# EAGLE board FootPlate_v1 (EAGLE 9.0.0)
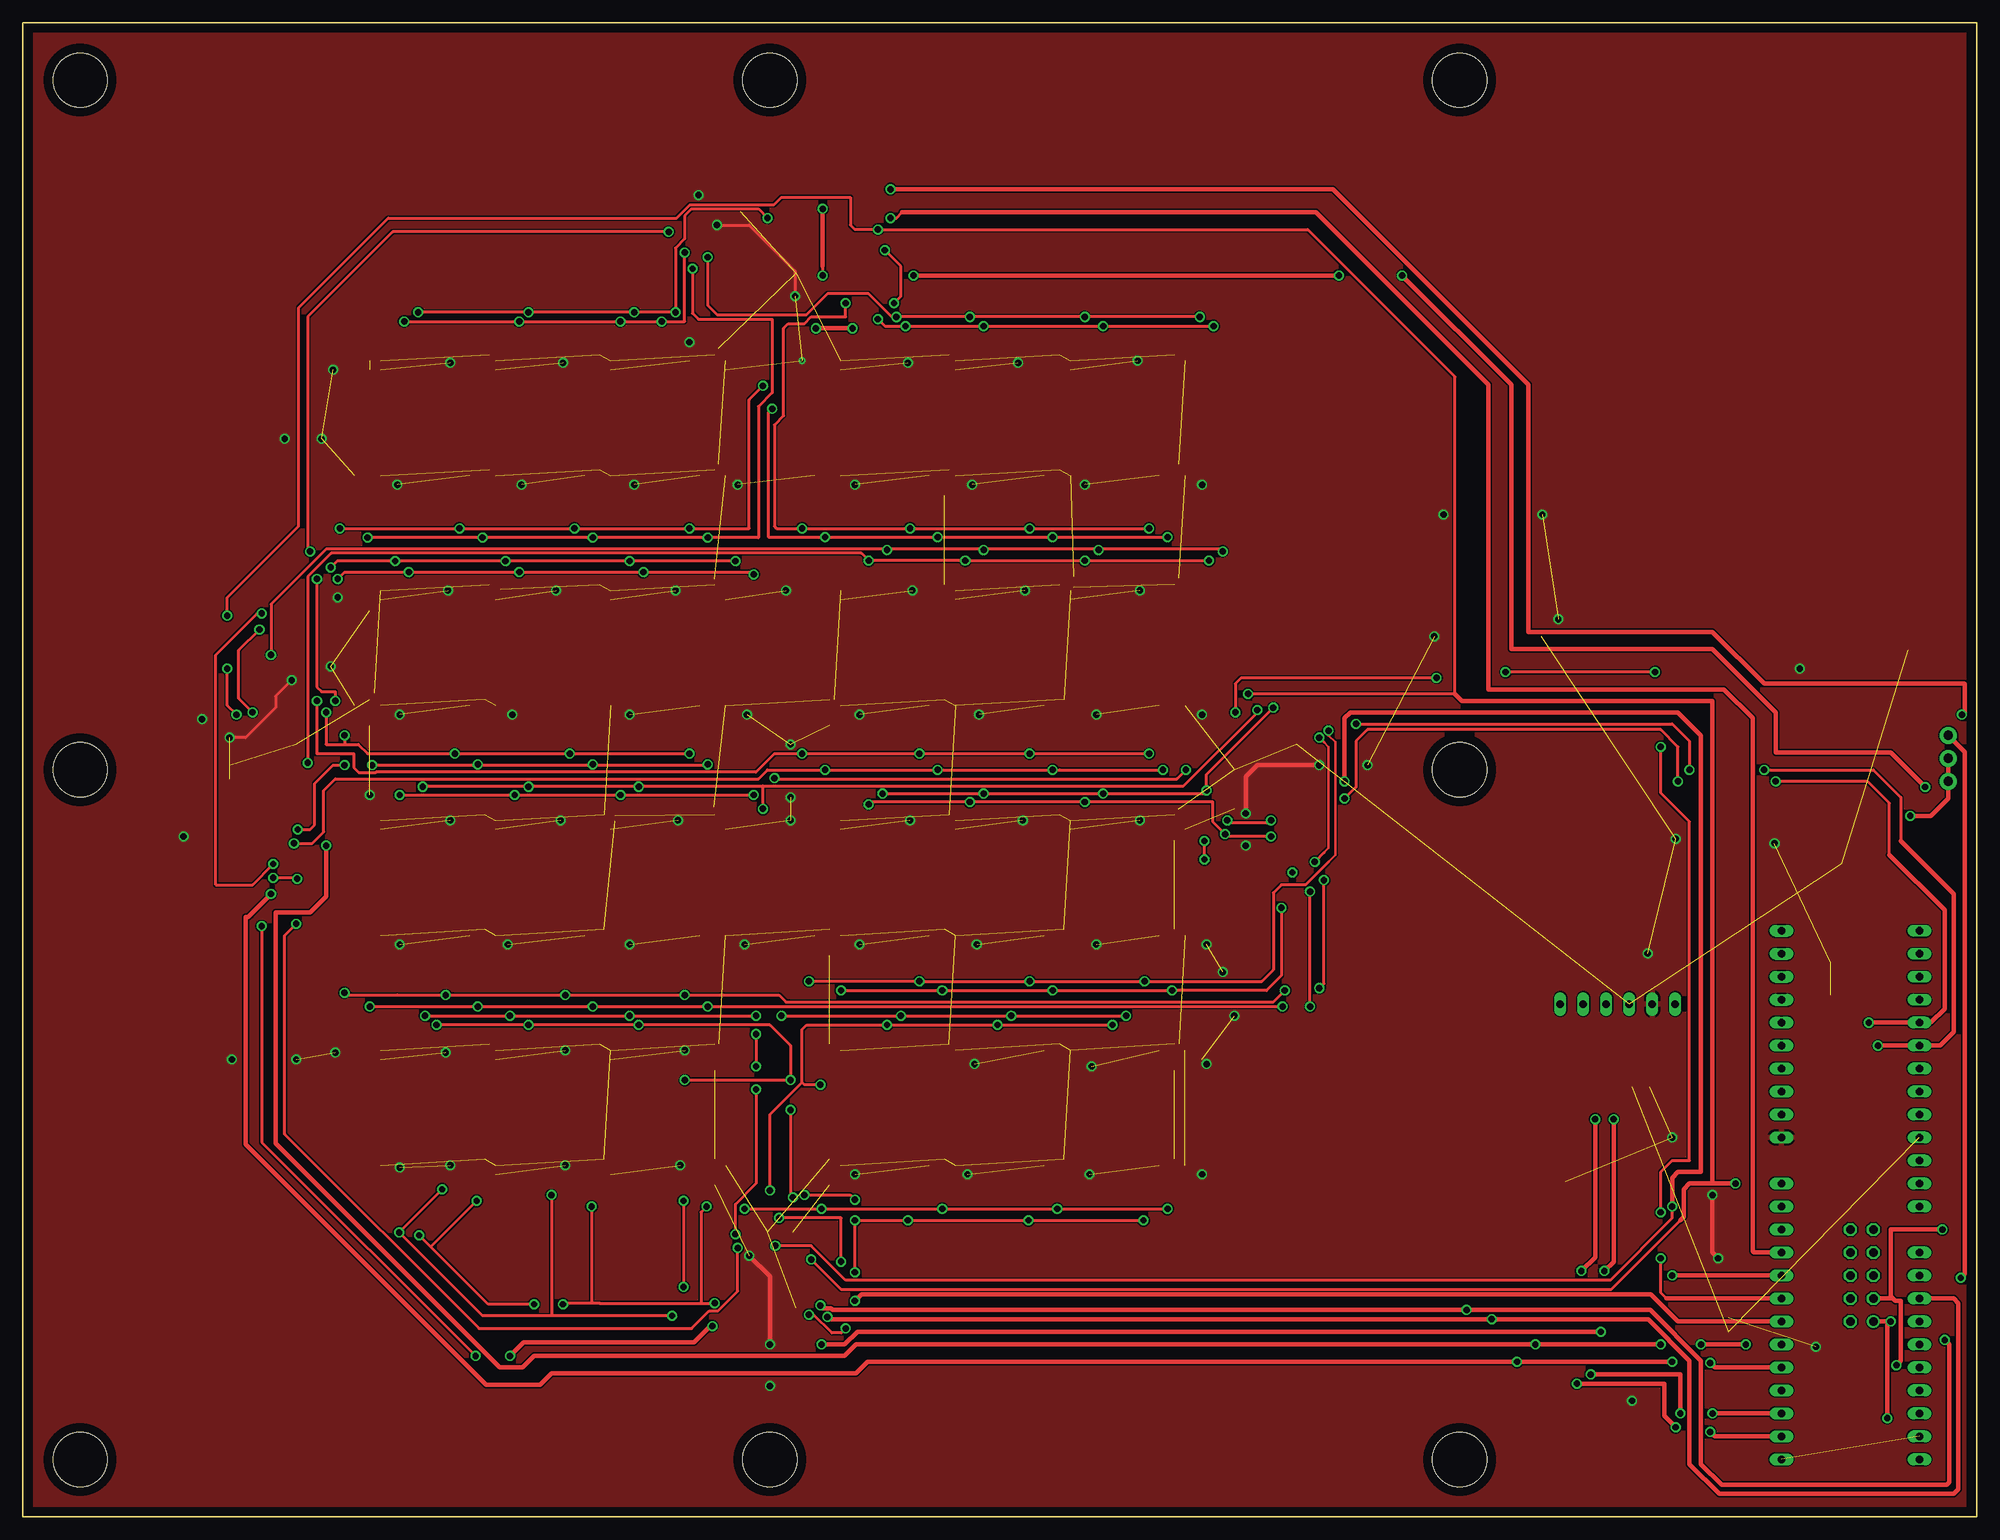
[diagram p5: board, top side]
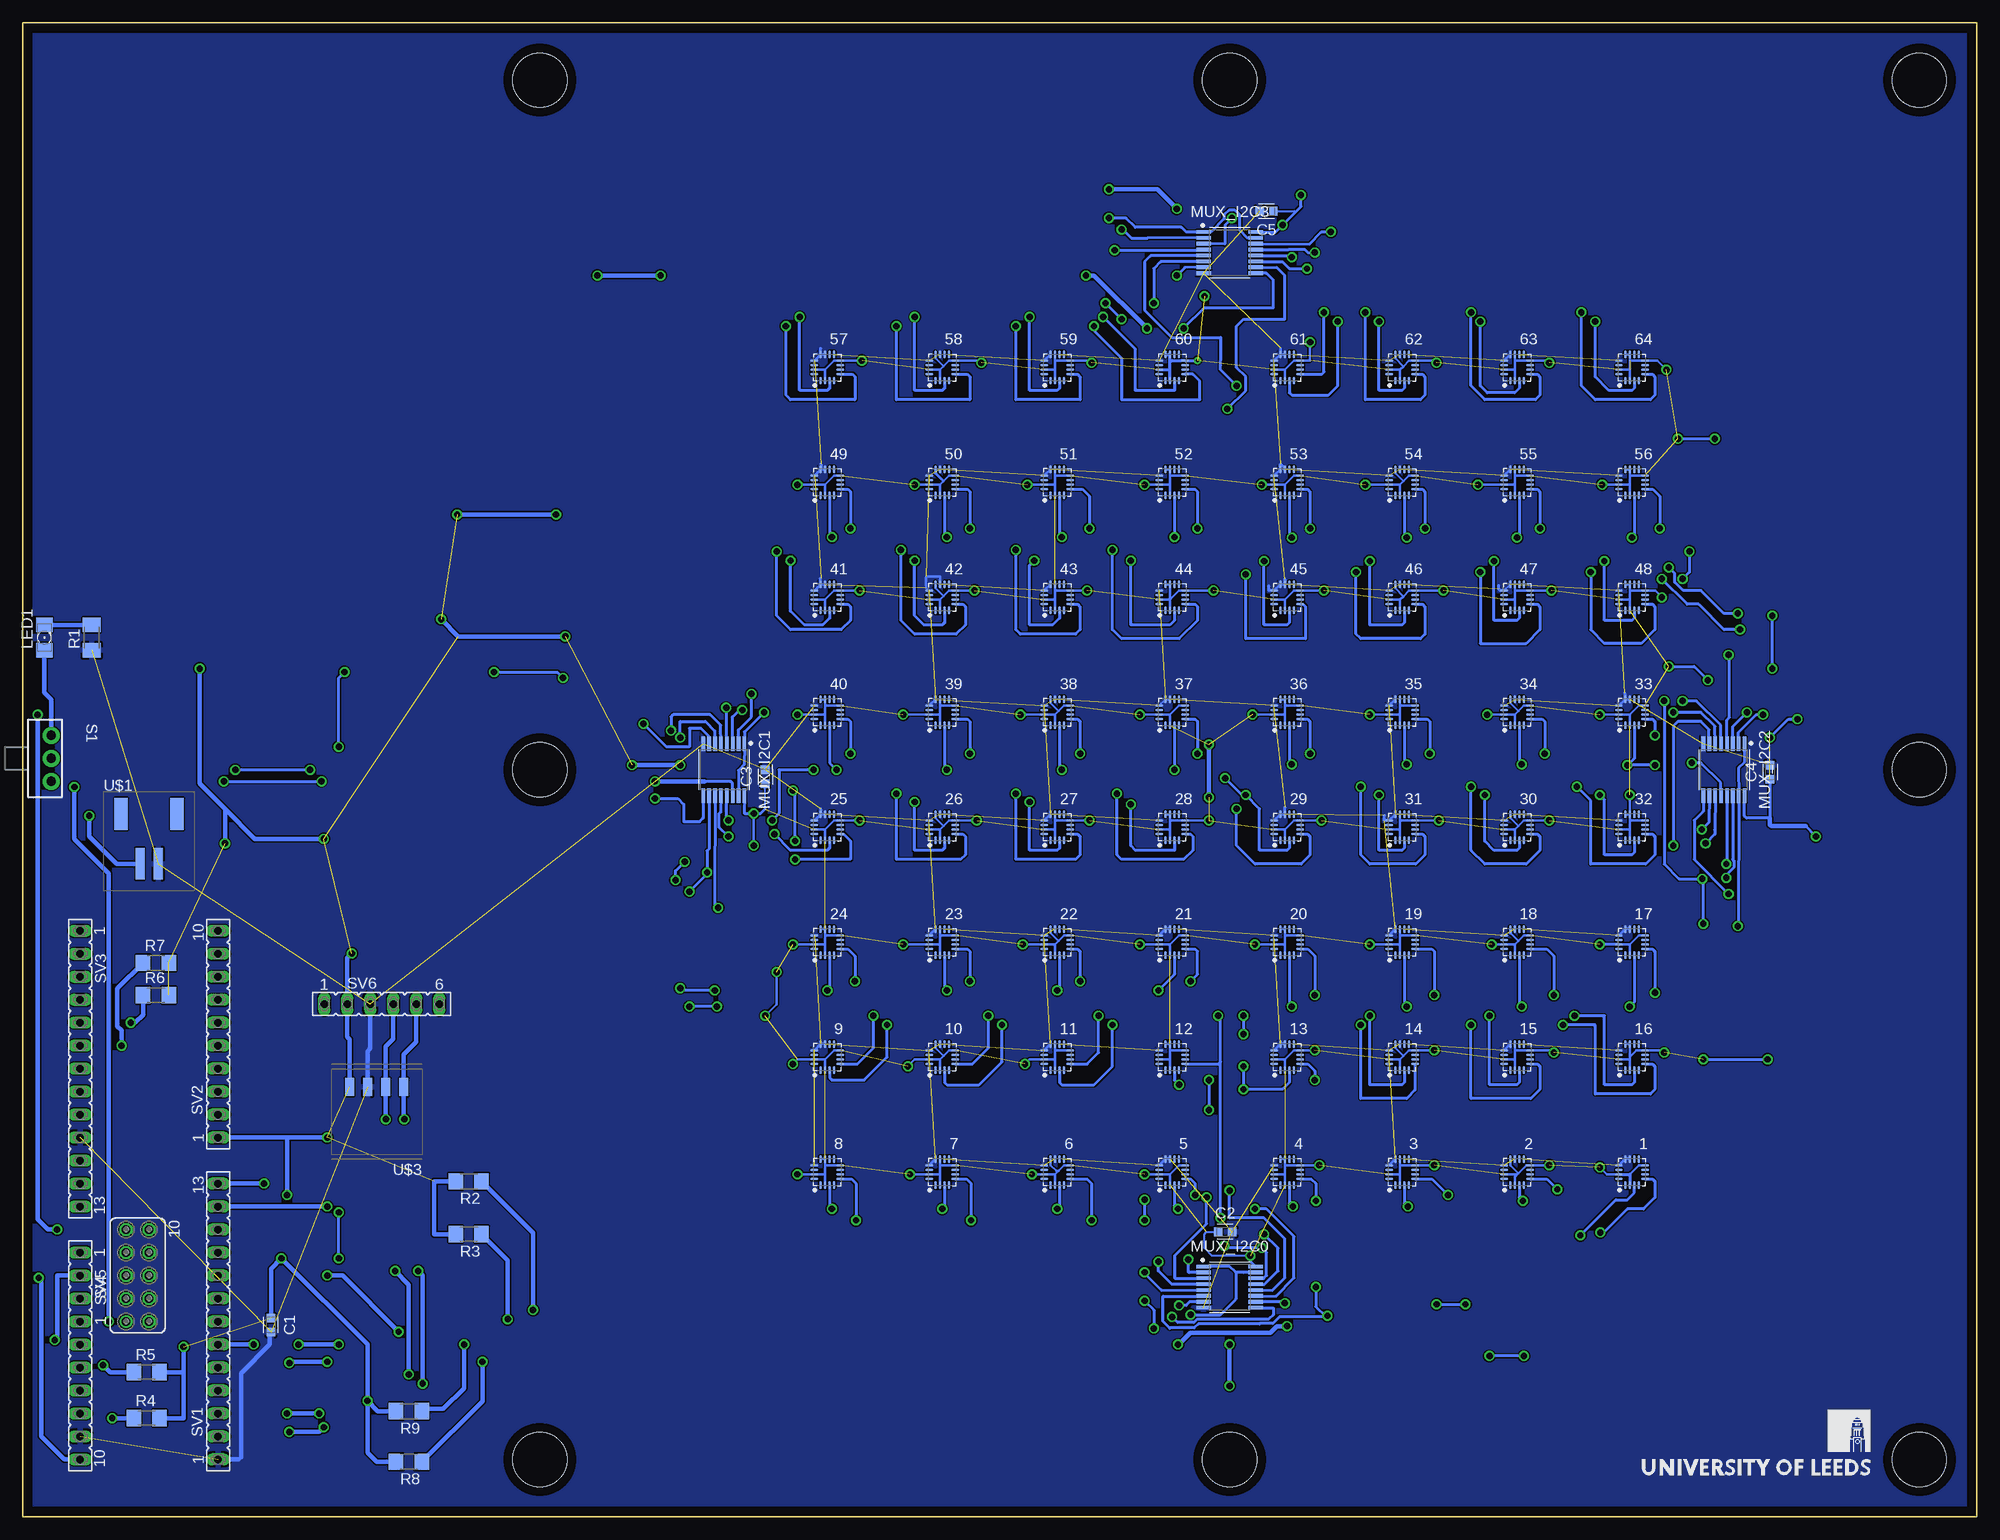
[diagram p6: board, bottom side, seen from below]

Size 215.9 x 165.1 mm. Coordinates in mm from the lower left corner, seen from the top.
Outline: 0,0 215.9,0 215.9,165.1 0,165.1 0,0
Copper layers (1*16): Top 0.035mm / dielectric 1.5mm / Bottom 0.035mm
Design rules "default": minimum track width 6mil, minimum drill 0.35mm, track to track 6mil, track to pad 6mil, pad to pad 6mil, via to via 6mil, smd to smd 6mil, copper to edge 40mil, drill to drill 6mil, minimum pad ring 10mil, minimum via ring 8mil, stop-mask expansion 4mil, vias tented up to drill 0mil, thermal gap 10mil
Holes 6 mm at 82.55,158.75 6.35,158.75 6.35,82.55 6.35,6.35 82.55,6.35 158.75,6.35 158.75,82.55 158.75,158.75

## Footprints (pad centres in the part's own frame; a part is rotated, then mirrored left to right if it is on the bottom)
MLX90393_PKG = smd 0.264 x 0.837: 4 0.75,-1.437; 9 0.75,1.437; 10 0.25,1.437; A0 -0.75,1.437; A1 -0.25,1.437; INT -0.75,-1.437; SCL 0.25,-1.437; SENB/CS -0.25,-1.437 | smd 0.837 x 0.264: 14 -1.437,0.25; 16 -1.437,-0.75; INT/TRIG 1.437,0.25; MISO 1.437,-0.25; SDA 1.437,-0.75; VDD -1.437,-0.25; VDD_IO 1.437,0.75; VSS -1.437,0.75
CAPC1608X75 = smd 0.931 x 0.98: 1 -0.77,0; 2 0.77,0
1206 = smd 1.6 x 1.803: A -1.422,0; C 1.422,0
SOP65P640X120-16 = smd 1.572 x 0.407: 1A -2.872,-1.625; 1B1 -2.872,-0.975; 1B2 -2.872,-0.325; 1B3 -2.872,0.325; 1B4 -2.872,0.975; 2A 2.872,-2.275; 2B1 2.872,-1.625; 2B2 2.872,-0.975; 2B3 2.872,-0.325; 2B4 2.872,0.325; !1OE -2.872,2.275; !2OE 2.872,1.625; GND -2.872,-2.275; S0 2.872,0.975; S1 -2.872,1.625; VCC 2.872,2.275
M1206 = smd 1.6 x 2: 1 -1.4,0; 2 1.4,0
R1206 = smd 1.6 x 1.803: 1 -1.422,0; 2 1.422,0
SWITCH = drill 1.016 pad 1.88: 1 0,2.54; 2 0,0; 3 0,-2.54
FE13 = drill 0.813 long: 1 -15.24,0; 2 -12.7,0; 3 -10.16,0; 4 -7.62,0; 5 -5.08,0; 6 -2.54,0; 7 0,0; 8 2.54,0; 9 5.08,0; 10 7.62,0; 11 10.16,0; 12 12.7,0; 13 15.24,0
FE10 = drill 0.813 long: 1 -11.43,0; 2 -8.89,0; 3 -6.35,0; 4 -3.81,0; 5 -1.27,0; 6 1.27,0; 7 3.81,0; 8 6.35,0; 9 8.89,0; 10 11.43,0
FE05-2 = drill 0.914: 1 -5.08,1.27 | drill 0.914 octagon: 2 -5.08,-1.27; 3 -2.54,1.27; 4 -2.54,-1.27; 5 0,1.27; 6 0,-1.27; 7 2.54,1.27; 8 2.54,-1.27; 9 5.08,1.27; 10 5.08,-1.27
FE06 = drill 0.813 long: 1 -6.35,0; 2 -3.81,0; 3 -1.27,0; 4 1.27,0; 5 3.81,0; 6 6.35,0
JST_PKG = smd 1 x 3.5: +3.7V -1,-2; GND 1,-2 | smd 1.5 x 3.5: P$3 -3.1,3.5; P$4 3.1,3.5
90DEG_F_HEADER_PKG = smd 1 x 2: 1 -3,0; 2 -1,0; 3 1,0; 4 3,0

## Placement (x,y rotation side)
1  0x00  [MLX90393_PKG]  38.1,38.1 0 bottom
2  0x01  [MLX90393_PKG]  50.8,38.1 0 bottom
3  0x10  [MLX90393_PKG]  63.5,38.1 0 bottom
4  0x11  [MLX90393_PKG]  76.2,38.1 0 bottom
5  0x00  [MLX90393_PKG]  88.9,38.1 0 bottom
6  0x01  [MLX90393_PKG]  101.6,38.1 0 bottom
7  0x10  [MLX90393_PKG]  114.3,38.1 0 bottom
8  0x11  [MLX90393_PKG]  127,38.1 0 bottom
9  0x00  [MLX90393_PKG]  127,50.8 0 bottom
10  0x01  [MLX90393_PKG]  114.3,50.8 0 bottom
11  0x10  [MLX90393_PKG]  101.6,50.8 0 bottom
12  0x11  [MLX90393_PKG]  88.9,50.8 0 bottom
13  0x00  [MLX90393_PKG]  76.2,50.8 0 bottom
14  0x01  [MLX90393_PKG]  63.5,50.8 0 bottom
15  0x10  [MLX90393_PKG]  50.8,50.8 0 bottom
16  0x11  [MLX90393_PKG]  38.1,50.8 0 bottom
17  0x00  [MLX90393_PKG]  38.1,63.5 0 bottom
18  0x01  [MLX90393_PKG]  50.8,63.5 0 bottom
19  0x10  [MLX90393_PKG]  63.5,63.5 0 bottom
20  0x11  [MLX90393_PKG]  76.2,63.5 0 bottom
21  0x00  [MLX90393_PKG]  88.9,63.5 0 bottom
22  0x01  [MLX90393_PKG]  101.6,63.5 0 bottom
23  0x10  [MLX90393_PKG]  114.3,63.5 0 bottom
24  0x11  [MLX90393_PKG]  127,63.5 0 bottom
25  0x00  [MLX90393_PKG]  127,76.2 0 bottom
26  0x01  [MLX90393_PKG]  114.3,76.2 0 bottom
27  0x10  [MLX90393_PKG]  101.6,76.2 0 bottom
28  0x11  [MLX90393_PKG]  88.9,76.2 0 bottom
29  0x00  [MLX90393_PKG]  76.2,76.2 0 bottom
30  0x01  [MLX90393_PKG]  50.8,76.2 0 bottom
31  0x10  [MLX90393_PKG]  63.5,76.2 0 bottom
32  0x11  [MLX90393_PKG]  38.1,76.2 0 bottom
33  0x00  [MLX90393_PKG]  38.1,88.9 0 bottom
34  0x01  [MLX90393_PKG]  50.8,88.9 0 bottom
35  0x10  [MLX90393_PKG]  63.5,88.9 0 bottom
36  0x11  [MLX90393_PKG]  76.2,88.9 0 bottom
37  0x00  [MLX90393_PKG]  88.9,88.9 0 bottom
38  0x01  [MLX90393_PKG]  101.6,88.9 0 bottom
39  0x10  [MLX90393_PKG]  114.3,88.9 0 bottom
40  0x11  [MLX90393_PKG]  127,88.9 0 bottom
41  0x00  [MLX90393_PKG]  127,101.6 0 bottom
42  0x01  [MLX90393_PKG]  114.3,101.6 0 bottom
43  0x10  [MLX90393_PKG]  101.6,101.6 0 bottom
44  0x11  [MLX90393_PKG]  88.9,101.6 0 bottom
45  0x00  [MLX90393_PKG]  76.2,101.6 0 bottom
46  0x01  [MLX90393_PKG]  63.5,101.6 0 bottom
47  0x10  [MLX90393_PKG]  50.8,101.6 0 bottom
48  0x11  [MLX90393_PKG]  38.1,101.6 0 bottom
49  0x00  [MLX90393_PKG]  127,114.3 0 bottom
50  0x01  [MLX90393_PKG]  114.3,114.3 0 bottom
51  0x10  [MLX90393_PKG]  101.6,114.3 0 bottom
52  0x11  [MLX90393_PKG]  88.9,114.3 0 bottom
53  0x00  [MLX90393_PKG]  76.2,114.3 0 bottom
54  0x01  [MLX90393_PKG]  63.5,114.3 0 bottom
55  0x10  [MLX90393_PKG]  50.8,114.3 0 bottom
56  0x11  [MLX90393_PKG]  38.1,114.3 0 bottom
57  0x00  [MLX90393_PKG]  127,127 0 bottom
58  0x01  [MLX90393_PKG]  114.3,127 0 bottom
59  0x10  [MLX90393_PKG]  101.6,127 0 bottom
60  0x11  [MLX90393_PKG]  88.9,127 0 bottom
61  0x00  [MLX90393_PKG]  76.2,127 0 bottom
62  0x01  [MLX90393_PKG]  63.5,127 0 bottom
63  0x10  [MLX90393_PKG]  50.8,127 0 bottom
64  0x11  [MLX90393_PKG]  38.1,127 0 bottom
C1  0.1uF  [CAPC1608X75]  188.47,21.21 270 bottom
C2  0.1uF  [CAPC1608X75]  83.06,31.5 0 bottom
C3  0.1uF  [CAPC1608X75]  133.86,81.79 90 bottom
C4  0.1uF  [CAPC1608X75]  22.86,82.3 90 bottom
C5  0.1uF  [CAPC1608X75]  78.49,144.27 180 bottom
LED1  [1206]  213.49,97.16 90 bottom
MUX_I2C0  SN74_MUXMUX_PKG_V2  [SOP65P640X120-16]  82.55,25.4 0 bottom
MUX_I2C1  SN74_MUXMUX_PKG_V2  [SOP65P640X120-16]  138.43,82.55 270 bottom
MUX_I2C2  SN74_MUXMUX_PKG_V2  [SOP65P640X120-16]  27.94,82.55 270 bottom
MUX_I2C3  SN74_MUXMUX_PKG_V2  [SOP65P640X120-16]  82.55,139.7 0 bottom
R1  80 Ohm  [M1206]  208.28,97.16 90 bottom
R2  4.7k  [R1206]  166.62,37.08 180 bottom
R3  4.7k  [R1206]  166.62,31.24 180 bottom
R4  4.7k  [R1206]  202.18,10.92 0 bottom
R5  4.7k  [R1206]  202.18,16 0 bottom
R6  4.7k  [R1206]  201.17,57.66 0 bottom
R7  4.7k  [R1206]  201.17,61.21 0 bottom
R8  4.7k  [R1206]  173.23,6.1 180 bottom
R9  4.7k  [R1206]  173.23,11.68 180 bottom
S1  [SWITCH]  212.72,83.82 0 bottom
SV1  [FE13]  194.31,21.59 90 bottom
SV2  [FE10]  194.31,53.34 90 bottom
SV3  [FE13]  209.55,49.53 270 bottom
SV4  [FE10]  209.55,17.78 270 bottom
SV5  [FE05-2]  203.2,26.67 90 bottom
SV6  [FE06]  176.23,56.67 0 bottom
U$1  JST_CONNECTOR  [JST_PKG]  201.93,74.17 0 bottom
U$2  [LOGO_LARGE]  37.05,4.55 0 bottom
U$3  90DEG_F_HEADER  [90DEG_F_HEADER_PKG]  176.78,47.5 180 bottom

## Tracks (layer width: path | path; a pad name or v marks a point on that pad's centre or on a via)
!OE0  (via drill 0.7 pad 0.7)
  Top 0.305: v90.93,20.83 90.42,20.32 89.41,20.32 87.38,22.35 v86.87,22.35
  Top 0.508: SV1.7 182.88,21.59 180.97,23.5 180.59,23.88 179.88,24.59 92.66,24.59 v91.95,23.88
  Bottom 0.305: MUX_I2C0.!2OE 81.03,27 81.86,27 | 81.86,27 82.55,27.69 85.26,27.69 MUX_I2C0.!1OE | v91.95,23.88 90.93,22.86 v90.93,20.83 | 81.86,27 81.86,24.05 83.57,22.35 v86.87,22.35
!OE1  (via drill 0.7 pad 0.95)
  Top 0.305: 181.61,24.13 180.97,24.77 v180.97,28.57 | v180.97,33.66 180.97,38.1 182.25,39.37 184.15,39.37 184.15,76.83 180.97,80.01 v180.97,85.09 | v180.34,93.34 v163.83,93.34 | v156.21,92.71 134.62,92.71 133.99,92.08 v133.99,88.9
  Top 0.508: SV1.8 181.61,24.13
  Bottom 0.305: MUX_I2C1.!2OE 136.83,82.47 136.18,83.12 136.16,85.09 | MUX_I2C1.!1OE 136.16,85.09 | v180.97,28.57 v180.97,33.66 | v180.97,85.09 180.97,92.71 v180.34,93.34 | v163.83,93.34 156.84,93.34 v156.21,92.71 | 136.16,85.09 136.16,86.73 v133.99,88.9
!OE2  (via drill 0.7 pad 0.7, 0.7 pad 0.95)
  Top 0.305: v26.42,65.28 26.42,41.4 v50.04,17.78
  Top 0.508: v53.85,17.78 55.37,19.3 74.17,19.3 75.95,21.08 v76.2,21.08 | v174.36,20.46 92.21,20.46 90.81,19.05 v88.27,19.05 | SV1.9 v182.25,26.67
  Bottom 0.305: MUX_I2C2.!1OE 25.69,83.38 26.34,82.73 MUX_I2C2.!2OE 26.34,65.35 v26.42,65.28 | v50.04,17.78 v53.85,17.78
  Bottom 0.508: v76.2,21.08 77.3,21.08 78.06,20.32 86.87,20.32 88.14,19.05 v88.27,19.05 | v182.25,26.67 180.57,26.67 v174.36,20.46
!OE3  (via drill 0.7 pad 0.95)
  Top 0.305: v95.89,143.51 96.52,143.51 97.16,144.15
  Top 0.508: 97.16,144.15 142.88,144.15 161.93,125.09 161.93,91.44 187.96,91.44 191.13,88.27 191.13,29.34 191.26,29.21 SV1.10
  Bottom 0.305: MUX_I2C3.!2OE 80.59,141.3 81.44,142.14 81.44,143.87 81.94,144.37 82.65,144.37 83.15,143.87 83.15,143.41 84.62,141.95 MUX_I2C3.!1OE 87.34,141.95 87.88,142.49 92.96,142.49 93.98,143.51 v95.89,143.51
+3.7V  (via drill 0.7 pad 0.95)
  Top 0.508: S1.1 214.55,84.53 214.55,26.85 v214.12,26.42
  Bottom 0.508: v214.12,26.42 213.87,26.16 213.87,8.89 211.33,6.35 SV4.10 | S1.1 212.72,90.3 213.49,91.06 LED1.A
BT_RX  (via drill 0.7 pad 0.95)
  Top 0.508: SV1.2 186.94,8.89 v186.44,9.4 | v173.74,43.94 173.74,28.7 v172.21,27.18 | v171.7,14.73 181.36,14.73 181.36,11.18 v182.63,9.91
  Bottom 0.508: v173.74,43.94 173.78,43.99 U$3.1 173.78,51.11 172.41,52.48 SV6.5 | v172.21,27.18 171.7,26.67 v171.7,14.73 | v182.63,9.91 183.13,9.4 v186.44,9.4
BT_TX  (via drill 0.7 pad 0.95)
  Top 0.508: SV1.3 v186.69,11.43 | v183.13,11.43 183.13,15.75 v173.23,15.75 | v174.75,27.18 175.77,28.19 v175.77,43.94
  Bottom 0.508: v186.69,11.43 v183.13,11.43 | v173.23,15.75 173.23,25.65 v174.75,27.18 | v175.77,43.94 175.77,47.48 U$3.2 175.78,52 174.96,52.83 SV6.4
GND  (92 unrouted)
  Bottom 0.254: 37.A1 37.A0 37.VSS | 47.A0 47.VSS | 42.A1 114.55,103.89 116.08,103.89 116.08,102.69 42.VSS
  Bottom 0.305: 1.A1 1.A0 1.VSS | 17.A1 17.A0 17.VSS | 63.A0 63.VSS | 61.A1 61.A0 | 61.A0 61.VSS | 59.A0 59.VSS | 57.A1 57.A0 | 57.A0 57.VSS | 49.A1 49.A0 | 49.A0 49.VSS | 51.A0 51.VSS | 53.A1 76.5,115.74 76.5,115.93 76.91,116.33 76.95,116.29 53.A0 53.VSS | 55.A0 55.VSS | 43.A0 43.VSS | 41.A1 41.A0 | 41.A0 41.VSS | 39.A0 39.VSS | 35.A0 35.VSS | 33.A1 33.A0 | 33.A0 33.VSS | 31.A0 31.VSS 65.39,76.95 65.43,76.91 65.43,77.52 | 29.VSS 29.A0 29.A1 76.45,78.39 76.4,78.44 | 27.A0 27.VSS | 25.A1 25.A0 | 25.A0 25.VSS | 23.A0 23.VSS | 21.A1 21.A0 21.VSS | 19.A0 19.VSS | 15.A0 15.VSS | 13.A1 13.A0 13.VSS | 11.A0 11.VSS | 9.A1 9.A0 9.VSS | 7.A0 7.VSS | 5.A1 5.A0 5.VSS | 3.A0 3.VSS | 45.A1 76.45,103.63 45.A1 45.A0 45.VSS 77.65,102.36 78.23,102.36 78.23,102.87 | 127.71,116.33 127.71,115.78 49.A0 | 57.A0 127.75,129.09 127.71,129.13 | 61.A0 76.91,128.48 76.91,129.13 | 47.VSS 52.67,102.35 52.83,102.51 52.83,102.92 | 41.A0 127.75,103.69 127.71,103.73 | 33.A0 38.85,90.97 38.91,91.03 | 25.A0 127.71,77.68 127.71,78.23
  Bottom 0.508: C1.2 188.59,20.31 188.59,19.05 191.77,15.88 191.77,6.6 192.02,6.35 SV1.1 | SV6.3 177.5,51.74 177.78,51.45 U$3.3
  pour Bottom: -2.54,165.35 -2.54,-1.78 -1.02,-3.3 218.19,-3.05 218.19,163.32 216.66,164.85 -2.03,164.85
N$1
  Bottom 0.508: R1.2 213.97,98.56 LED1.C
N$2  (via drill 0.7 pad 0.95)
  Top 0.508: S1.2 S1.3 212.72,79.38 210.82,77.47 v208.53,77.47
  Bottom 0.508: U$1.+3.7V 205.52,72.17 208.53,75.18 v208.53,77.47
S0  (via drill 0.7 pad 0.7, 0.7 pad 0.95)
  Top 0.305: v78.99,29.72 78.99,24.95 76.81,22.76 75.85,22.76 73.91,20.83 50.41,20.83 28.96,42.28 28.96,64.26 v30.23,65.53 | v71.37,141.99 40.89,141.99 31.5,132.59 31.5,106.93 v31.75,106.68 | v34.54,90.17 34.54,91.19 33.02,91.19 32.51,91.69 v32.51,103.63 | v27.69,70.61 30.23,70.61 v30.32,70.51 | v83.15,29.97 87.12,29.97 90.93,26.16 175.39,26.16 182.25,33.02 v182.25,34.29
  Top 0.508: v182.25,34.29 182.25,37.47 182.88,38.1 185.42,38.1 185.42,86.36 182.88,88.9 146.69,88.9 146.05,88.27 v146.05,81.28
  Bottom 0.305: MUX_I2C0.S0 78.81,26.35 78.49,26.67 78.49,29.21 v78.99,29.72 82.9,29.72 v83.15,29.97 | v27.69,70.61 27.69,70.92 26.83,71.78 26.83,72.49 26.99,72.65 MUX_I2C2.S0 | MUX_I2C3.S0 73.73,140.65 72.39,141.99 v71.37,141.99 | v34.54,90.17 34.54,72.14 32.92,70.51 v30.32,70.51 30.23,70.42 v30.23,65.53 | MUX_I2C1.S0 137.48,81.09 137.67,81.28 140.56,81.28 | v31.75,106.68 31.75,104.39 v32.51,103.63
  Bottom 0.508: SV1.12 v182.25,34.29 | v146.05,81.28 140.56,81.28
S1  (via drill 0.7 pad 0.7, 0.7 pad 0.95)
  Top 0.305: v23.62,88.65 22.61,89.66 v22.61,93.73 | v22.61,99.57 22.61,101.6 30.48,109.47 30.48,133.6 40.39,143.51 72.25,143.51 73.72,144.98 83.01,144.98 83.82,145.8 91.44,145.8 91.44,142.75 91.95,142.24 v94.49,142.24 141.99,142.24 158.24,125.98 158.24,90.93 v135.38,90.93 | v87.12,28.45 90.42,25.15 175.51,25.15 183.13,32.77
  Top 0.508: 158.24,90.93 159,90.17 186.69,90.17 186.69,36.83 | 183.13,32.77 183.51,33.15 183.51,36.2 184.15,36.83 186.69,36.83 | 186.69,36.83 v189.23,36.83
  Bottom 0.305: MUX_I2C2.S1 26.34,86.69 24.38,88.65 v23.62,88.65 | v22.61,93.73 v22.61,99.57 | MUX_I2C3.S1 91.62,141.3 93.4,141.3 94.34,142.24 v94.49,142.24 | MUX_I2C1.S1 136.83,86.94 135.38,88.39 v135.38,90.93 | MUX_I2C0.S1 87.05,27 87.12,27.08 v87.12,28.45
  Bottom 0.508: v189.23,36.83 SV1.13
SCL0  (via drill 0.7, 0.7 pad 0.95)
  Top 0.508: SV4.3 213.36,24.13 213.87,23.62 213.87,3.05 213.36,2.54 187.45,2.54 184.15,5.84 184.15,17.27 179.58,21.84 v162.31,21.84 89.15,21.84 v88.9,22.1
  Bottom 0.305: MUX_I2C0.2A 77.74,23.1 77.74,22.35 78.25,21.84 86.16,21.84 86.51,21.49 88.3,21.49 v88.9,22.1
  Bottom 0.508: R3.1 162.31,28.35 v162.31,21.84
SCL0_0  (via drill 0.7 pad 0.95)
  Top 0.305: 63.75,23.62 74.93,23.62 | 74.93,23.62 v76.45,23.62 v76.45,23.63 | 63.75,23.63 63.75,23.62 | v75.56,34.29 74.93,33.66 74.93,23.62 | 63.75,23.62 62.87,23.62 | 62.87,23.62 59.82,23.62 v59.69,23.5 | v56.52,23.5 51.44,23.5 45.09,29.84 | 45.09,29.84 v43.81,31.11 | v50.16,34.92 45.09,29.84 | v62.87,34.29 62.87,23.62
  Bottom 0.305: v76.45,23.62 76.58,23.75 MUX_I2C0.2B1 | 4.SCL 75.95,34.67 v75.56,34.29 | 3.SCL 63.25,34.67 v62.87,34.29 | v59.69,23.5 v56.52,23.5 | 1.SCL 37.85,35.81 38.61,35.05 39.88,35.05 v43.81,31.11 | 2.SCL 50.55,35.31 v50.16,34.92
SCL0_1  (via drill 0.7 pad 0.95)
  Top 0.305: v79.76,34.04 v88.27,34.04 v101.6,34.04 v114.3,34.04 v126.49,34.04
  Bottom 0.305: MUX_I2C0.2B2 77.45,24.4 75.44,26.42 75.44,30.99 78.49,34.04 v79.76,34.04 | 5.SCL 88.65,34.42 v88.27,34.04 | 6.SCL 101.35,34.29 v101.6,34.04 | 7.SCL 114.05,34.29 v114.3,34.04 | 8.SCL 126.75,34.29 v126.49,34.04
SCL0_2  (via drill 0.7 pad 0.95)
  Top 0.305: v82.55,36.07 82.55,44.45 86.11,48.01 | 86.11,48.01 86.11,53.85 86.61,54.36 v95.5,54.36 v107.7,54.36 v120.4,54.36 | 86.11,48.01 86.36,47.75 v88.14,47.75
  Bottom 0.305: MUX_I2C0.2B3 77.82,25.05 76.45,26.42 76.45,30.73 78.74,33.02 82.55,33.02 v82.55,36.07 | 12.SCL 88.65,48.26 v88.14,47.75 | 11.SCL 101.35,48.01 101.09,47.75 97.54,47.75 95.5,49.78 v95.5,54.36 | 10.SCL 114.05,48.01 113.79,47.75 110.24,47.75 107.7,50.29 v107.7,54.36 | 9.SCL 126.75,48.52 126.49,48.26 122.94,48.26 120.4,50.8 v120.4,54.36
SCL0_3  (via drill 0.7 pad 0.95)
  Top 0.305: v78.74,31.24 78.74,34.54 81.03,36.83 v81.03,47.24 | v81.03,53.34 v81.03,49.78 | v44.45,55.37 v53.85,55.37 v67.06,55.37 v81.03,55.37
  Bottom 0.305: MUX_I2C0.2B4 78.69,25.7 77.22,27.18 77.22,29.72 v78.74,31.24 | v81.03,55.37 v81.03,53.34 | v81.03,49.78 v81.03,47.24 76.71,47.24 75.95,48 13.SCL | 16.SCL 37.85,48 38.1,47.75 41.15,47.75 41.15,55.37 v44.45,55.37 | 15.SCL 50.55,48 50.8,47.75 53.85,47.75 v53.85,55.37 | 14.SCL 63.25,48 63.5,47.75 67.06,47.75 v67.06,55.37
SCL1  (via drill 0.7 pad 0.95)
  Top 0.305: 206.25,73.15 206.25,78.87 203.84,81.28 v193.68,81.28 | v182.88,81.28 182.88,85.09 180.97,87 148.59,87 147.32,85.72 147.32,80.64 v146.05,79.38
  Top 0.508: 206.25,73.15 212.34,67.06 212.34,56.13 210.82,54.61 SV3.5 v203.96,54.61
  Bottom 0.305: MUX_I2C1.2A 140.73,77.23 140.72,77.22 141.1,76.83 142.88,76.83 142.88,78.74 143.51,79.38 v146.05,79.38 | v193.68,81.28 v182.88,81.28
  Bottom 0.508: R6.1 202.59,55.47 203.45,54.61 v203.96,54.61
SCL1_0  (via drill 0.7, 0.7 pad 0.95)
  Top 0.305: v142.24,56.39 v142.24,69.09 | v38.35,56.39 v50.29,56.39 v62.99,56.39 v75.69,56.39 v139.19,56.39
  Bottom 0.305: MUX_I2C1.2B1 140.08,73.79 140.29,73.58 v140.29,71.2 140.29,71.04 v142.24,69.09 | v139.19,56.39 v142.24,56.39 | 17.SCL 37.85,56.89 v38.35,56.39 | 18.SCL 50.55,56.65 v50.29,56.39 | 19.SCL 63.25,56.65 v62.99,56.39 | 20.SCL 75.95,56.65 v75.69,56.39
SCL1_1  (via drill 0.7 pad 0.95)
  Top 0.305: v90.42,58.17 v101.6,58.17 v113.79,58.17 114.55,58.17 | 114.55,58.17 v127,58.17 137.41,58.17 139.06,59.82 v139.06,67.31 | 114.55,58.17
  Bottom 0.305: MUX_I2C1.2B2 139.43,68.58 | 139.43,68.58 139.43,68.33 | 23.SCL 114.05,58.42 v113.79,58.17 | 22.SCL 101.35,58.42 v101.6,58.17 | 24.SCL 126.75,58.42 v127,58.17 | 139.43,68.58 139.43,67.67 v139.06,67.31 | 21.SCL 88.65,59.94 v90.42,58.17
SCL1_2  (via drill 0.7 pad 0.95)
  Top 0.305: v93.47,78.74 93.73,78.99 v104.65,78.99 v117.35,78.99 131.48,78.99 131.48,76.8 v132.84,75.44 133.1,75.18 v137.92,75.18
  Bottom 0.305: v137.92,75.18 138.94,76.2 138.94,77.72 138.78,77.88 MUX_I2C1.2B3 | 28.SCL 88.65,73.66 92.96,73.66 93.47,74.17 v93.47,78.74 | 27.SCL 101.35,73.91 101.6,73.66 104.65,73.66 v104.65,78.99 | 26.SCL 114.05,73.91 114.3,73.66 117.35,73.66 v117.35,78.99 | 25.SCL 126.75,73.91 127,73.66 131.06,73.66 v132.84,75.44
SCL1_3  (via drill 0.7 pad 0.95)
  Top 0.305: v133.1,76.96 133.35,76.71 137.67,76.71 v137.92,76.96 | v83.06,81.63 83.06,81.53 127.51,81.53 v128.52,82.55 | v41.66,79.76 v54.36,79.76 v66.04,79.76 v80.77,79.76
  Bottom 0.305: MUX_I2C1.2B4 138.13,77.17 v137.92,76.96 | v133.1,76.96 132.33,77.72 132.33,82.55 v128.52,82.55 | v83.06,81.63 81.18,79.76 v80.77,79.76 79.25,78.23 79.25,73.66 76.2,73.66 75.95,73.91 29.SCL | 32.SCL 37.85,73.4 38.1,73.15 41.15,73.15 41.15,79.25 v41.66,79.76 | 30.SCL 50.55,73.91 50.8,73.66 53.34,73.66 54.36,74.68 v54.36,79.76 | 31.SCL 63.25,73.91 63.5,73.66 66.04,73.66 v66.04,79.76
SCL2  (via drill 0.7 pad 0.7, 0.7 pad 0.95)
  Top 0.508: v27.43,68.83 24.89,66.29 24.64,66.29 24.64,41.15 51.18,14.61 57.15,14.61 58.42,15.88 92.08,15.88 93.34,17.14 v165.1,17.14 v182.25,17.14 | v186.44,17.02 186.94,16.51 SV1.5
  Bottom 0.305: v27.43,68.83 31.24,72.64 31.24,76.96 30.24,77.96 MUX_I2C2.2A
  Bottom 0.508: v182.25,17.14 186.31,17.14 v186.44,17.02 | R8.1 165.1,12.8 v165.1,17.14
SCL2_0  (via drill 0.7 pad 0.95)
  Top 0.305: v30.38,75.95 31.75,75.95 32.26,76.45 32.26,81.03 34.29,83.06 v35.56,83.06 | 38.35,83.06 v38.61,83.06 50.29,83.06 | 50.29,83.06 62.99,83.06 | 62.99,83.06 75.69,83.06 v75.69,83.15 | v50.29,83.15 50.29,83.06 | v62.99,83.15 62.99,83.06
  Bottom 0.305: MUX_I2C2.2B1 29.59,76.74 v30.38,75.95 | v35.56,83.06 v38.61,83.06 37.85,83.82 33.SCL | 34.SCL 50.55,83.41 v50.29,83.15 | 35.SCL 63.25,83.41 v62.99,83.15 | 36.SCL 75.95,83.41 v75.69,83.15
SCL2_1  (via drill 0.7 pad 0.95)
  Top 0.305: v29.97,74.42 32,74.42 33.27,75.69 33.27,80.26 34.54,81.53 81.28,81.53 82.3,82.55 v88.65,82.55 v101.09,82.55 v113.79,82.55 114.55,82.55 | 114.55,82.55 | 114.55,82.55 v125.98,82.55
  Bottom 0.305: 28.96,79.68 MUX_I2C2.2B2 28.94,75.96 | 28.94,75.96 28.96,75.95 | 28.94,75.96 28.94,75.45 v29.97,74.42 | 37.SCL v88.65,82.55 | 38.SCL 101.35,82.81 v101.09,82.55 | 39.SCL 114.05,82.81 v113.79,82.55 | 40.SCL 126.75,83.32 v125.98,82.55
SCL2_2  (via drill 0.7 pad 0.95)
  Top 0.305: v31.5,83.31 31.5,103.89 34.09,106.48 92.66,106.48 v93.47,105.66 v104.14,105.66 v117.35,105.66 v131.06,105.66
  Bottom 0.305: MUX_I2C2.2B3 28.29,81.12 30.48,83.31 v31.5,83.31 | 44.SCL 88.65,99.06 89.15,98.55 93.47,98.55 v93.47,105.66 | 43.SCL 101.35,99.31 102.11,98.55 104.65,98.55 104.65,105.16 v104.14,105.66 | 41.SCL 126.75,99.31 127.51,98.55 129.54,98.55 131.06,100.08 v131.06,105.66 | 42.SCL 114.05,98.8 114.3,98.55 116.33,98.55 117.35,99.57 v117.35,105.66
SCL2_3  (via drill 0.7, 0.7 pad 0.95)
  Top 0.305: v27.69,72.14 25.4,69.85 21.34,69.85 21.34,95.25 25.91,99.82 v26.42,99.82 | 34.59,105.46 v34.04,104.9 34.8,105.66 41.15,105.66 | 41.15,105.66 53.34,105.66 | 53.34,105.66 67.06,105.66 | v41.15,105.62 41.15,105.66 | v53.34,105.62 53.34,105.66 | v67.06,105.62 67.06,105.66 | 67.06,105.66 78.74,105.66 v78.74,105.62
  Bottom 0.305: MUX_I2C2.2B4 27.64,72.18 v27.69,72.14 | v26.42,99.82 27.94,99.82 30.48,102.36 32.45,102.36 33.37,103.28 33.37,104.24 v34.04,104.9 | 48.SCL 37.85,99.31 38.1,99.06 41.15,99.06 v41.15,105.62 | 47.SCL 50.55,99.31 50.8,99.06 53.34,99.06 v53.34,105.62 | 46.SCL 63.25,98.8 63.5,98.55 67.06,98.55 v67.06,105.62 | 45.SCL 75.95,98.8 76.2,98.55 78.74,98.55 v78.74,105.62
SCL3  (via drill 0.7 pad 0.7, 0.7 pad 0.95)
  Top 0.508: v91.69,131.32 v87.63,131.32 | v210.19,80.64 206.38,84.45 193.68,84.45 193.68,88.9 186.69,95.89 164.47,95.89 164.47,125.09 v152.4,137.16 | v98.42,137.16 v145.41,137.16 | SV5.1 v206.38,21.59 205.99,21.21 v205.99,10.92
  Bottom 0.305: v87.63,131.32 85.34,133.6 77.72,133.6 77.72,136.65 78.49,137.41 78.5,137.4 MUX_I2C3.2A
  Bottom 0.508: v91.69,131.32 97.54,137.16 v98.42,137.16 | v206.38,21.59 206.38,22.35 206.38,71.12 210.19,74.93 v210.19,80.64 | v152.4,137.16 v145.41,137.16 | v205.99,10.92 R4.1
SCL3_0  (via drill 0.7 pad 0.95)
  Top 0.305: v126.49,108.25 v113.79,108.25 v101.09,108.25 v88.65,108.25 82.44,108.25 82.39,108.3 82.39,122.02 v82.8,122.43
  Bottom 0.305: MUX_I2C3.2B1 77.34,138.05 76.45,137.16 76.45,132.33 81.03,132.33 81.79,131.57 81.79,127 80.77,125.98 80.77,124.46 v82.8,122.43 | 52.SCL v88.65,108.25 | 51.SCL 101.35,108.51 v101.09,108.25 | 50.SCL 114.05,108.51 v113.79,108.25 | 49.SCL 126.75,108.51 v126.49,108.25
SCL3_1  (via drill 0.7, 0.7 pad 0.95)
  Top 0.305: v74.01,137.92 74.01,133 74.68,132.33 82.8,132.33 82.8,124.21 81.28,122.68 81.28,108.2 v75.69,108.2 v62.99,108.2 v50.8,108.2 v38.1,108.2
  Bottom 0.305: MUX_I2C3.2B2 79.68,138.68 76.71,138.68 75.95,137.92 v74.01,137.92 | 56.SCL 37.85,108.45 v38.1,108.2 | 55.SCL 50.55,108.45 v50.8,108.2 | 54.SCL 63.25,108.46 v62.99,108.2 | 53.SCL 75.95,108.46 v75.69,108.2
SCL3_2  (via drill 0.7, 0.7 pad 0.95)
  Top 0.305: v75.69,139.19 75.69,133.86 76.71,132.84 86.61,132.84 88.9,135.13 93.47,135.13 96.01,132.59 v96.52,132.59 v104.65,132.59 v117.35,132.59 v130.05,132.59
  Bottom 0.305: MUX_I2C3.2B3 75.85,139.35 v75.69,139.19 | v96.52,132.59 92.96,129.03 92.96,124.46 88.65,124.46 60.SCL | 59.SCL 101.35,124.71 101.6,124.46 104.65,124.46 v104.65,132.59 | 58.SCL 114.05,124.71 114.3,124.46 117.35,124.46 v117.35,132.59 | 57.SCL 126.75,124.71 127,124.46 130.05,124.46 v130.05,132.59
SCL3_3  (via drill 0.7, 0.7 pad 0.95)
  Top 0.305: v73.15,139.7 73.15,132.08 v70.61,132.08 v66.04,132.08 v54.86,132.08 v42.16,132.08
  Bottom 0.305: v73.15,139.7 73.91,139.7 74.26,140.05 76.05,140.05 76.1,140 MUX_I2C3.2B4 | 64.SCL 37.85,124.71 38.1,124.46 40.64,124.46 42.16,125.98 v42.16,132.08 | 63.SCL 50.55,124.71 51.05,124.21 54.1,124.21 54.86,124.97 v54.86,132.08 | 62.SCL 63.25,124.71 63.5,124.46 66.04,124.46 v66.04,132.08 | 61.SCL 75.95,124.21 75.69,123.95 71.63,123.95 70.61,124.97 v70.61,132.08
SDA0  (via drill 0.7, 0.7 pad 0.7, 0.7 pad 0.95)
  Top 0.508: v212.34,19.56 212.85,19.05 212.85,3.81 212.6,3.56 187.71,3.56 185.42,5.84 185.42,17.27 179.83,22.86 v159.51,22.86 89.5,22.86 89.3,23.06 88.45,23.06 v88.14,23.37
  Bottom 0.305: 85.35,23.7 MUX_I2C0.1A 86.99,23.75 87.38,23.37 v88.14,23.37
  Bottom 0.508: SV4.2 212.09,26.67 212.09,19.81 v212.34,19.56 | R2.1 159.51,31.39 v159.51,22.86
SDA0_0  (via drill 0.7 pad 0.95)
  Top 0.305: v71.75,22.23 58.42,22.23 | 58.42,22.23 50.8,22.23 v41.59,31.43 v46.35,36.2 | v58.42,35.56 58.42,22.23 | v73.03,34.92 v73.03,25.4
  Bottom 0.305: MUX_I2C0.1B1 85.32,24.38 89.92,24.38 89.92,21.59 89.15,20.83 89.1,20.88 86.48,20.88 86.02,21.34 79.25,21.34 79.2,21.39 77.79,21.39 77.08,22.1 71.88,22.1 | 71.88,22.1 v71.75,22.23 | 2.SDA 47.51,37.35 v46.35,36.2 | 3.SDA 60.21,37.35 v58.42,35.56 | 4.SDA 73.55,37.35 73.03,36.83 v73.03,34.92 | v73.03,25.4 73.03,23.24 71.88,22.1 | 1.SDA 35.83,37.35 35.56,37.08 35.56,35.31 36.83,34.04 38.61,34.04 41.21,31.43 v41.59,31.43
SDA0_1  (via drill 0.7 pad 0.95)
  Top 0.305: v91.95,27.02 v91.95,32.77 v97.79,32.77 v111.12,32.77 v123.83,32.77 | v86.36,35.56 91.44,35.56 v91.95,35.05
  Bottom 0.305: v91.95,35.05 v91.95,32.77 91.95,32.51 | MUX_I2C0.1B2 90.07,25.05 91.95,26.92 v91.95,27.02 | 5.SDA 86.88,37.35 86.36,36.83 v86.36,35.56 | 6.SDA 98.31,37.35 97.79,36.83 v97.79,32.77 | 7.SDA 111.64,37.35 111.12,36.83 v111.12,32.77 | 8.SDA 124.34,37.35 123.83,36.83 v123.83,32.77
SDA0_2  (via drill 0.7 pad 0.95)
  Top 0.305: v90.42,28.19 90.42,33.02 v83.57,33.02 | v83.82,55.37 v97.03,55.37 v109.22,55.37 v121.92,55.37
  Bottom 0.305: MUX_I2C0.1B3 88.95,25.7 90.42,27.18 v90.42,28.19 | v83.57,33.02 83.57,50.29 | 83.57,50.29 83.57,55.12 v83.82,55.37 | 12.SDA 83.81,50.05 83.57,50.29 | 11.SDA 98.29,50.05 97.03,51.31 v97.03,55.37 | 10.SDA 110.99,50.05 109.22,51.82 v109.22,55.37 | 9.SDA 123.69,50.05 121.92,51.82 v121.92,55.37
SDA0_3  (via drill 0.7 pad 0.95)
  Top 0.305: v84.84,44.96 84.84,35.56 v85.09,35.31 | v45.72,54.36 v55.88,54.36 v68.07,54.36 82.55,54.36 84.84,52.07 v84.84,48.26 v73.15,48.26
  Bottom 0.305: v84.84,48.26 v84.84,44.96 | MUX_I2C0.1B4 88.58,26.35 88.65,26.42 88.65,28.83 85.09,32.38 v85.09,35.31 | 14.SDA 62.06,47.16 62.99,46.23 68.07,46.23 v68.07,54.36 | 16.SDA 35.83,50.05 35.56,49.78 35.56,47.24 36.07,46.74 42.16,46.74 42.16,54.36 v45.72,54.36 | 15.SDA 48.53,50.05 48.26,49.78 48.26,47.24 49.28,46.23 55.88,46.23 v55.88,54.36 | 13.SDA 73.93,50.05 73.15,49.28 v73.15,48.26
SDA1  (via drill 0.7 pad 0.95)
  Top 0.305: v147.32,87.63 182.25,87.63 184.15,85.72 v184.15,82.55 | v192.41,82.55 204.47,82.55 207.52,79.5 207.52,74.68
  Top 0.508: 207.52,74.68 213.36,68.83 213.36,53.59 211.84,52.07 SV3.6 v204.98,52.07
  Bottom 0.305: MUX_I2C1.1A 140.08,86.23 140.97,87.12 142.24,87.12 142.24,85.09 144.78,85.09 v147.32,87.63 | v184.15,82.55 v192.41,82.55
  Bottom 0.508: v204.98,52.07 204.98,53.76 205.43,54.21 205.43,58.37 R7.1
SDA1_0  (via drill 0.7, 0.7 pad 0.95)
  Top 0.254: 143.76,85.6 144.27,85.09 144.27,73.92 144.27,73.91 143.76,73.41
  Top 0.305: v143.25,86.11 143.76,85.6 | 41.41,57.67 41.4,57.66 | 41.4,57.66 v46.74,57.66 v59.94,57.66 v73.15,57.66 83.57,57.66 84.33,56.9 138.18,56.9 v139.45,58.17 | v143.26,58.42 143.76,58.93 v143.76,70.36 | 143.76,73.41 v142.75,72.39 | v35.56,57.91 35.81,57.66 41.4,57.66
  Bottom 0.305: v143.25,86.11 143.25,87.88 143.26,87.88 140.46,87.88 139.43,86.85 MUX_I2C1.1B1 | v139.45,58.17 143,58.17 v143.26,58.42 | v143.76,70.36 143.76,71.37 v142.75,72.39 | 17.SDA 35.83,62.75 35.56,62.48 v35.56,57.91 | 18.SDA 47.51,62.75 46.74,61.98 v46.74,57.66 | 19.SDA 60.21,62.75 59.94,62.48 v59.94,57.66 | 20.SDA 73.93,62.75 73.15,61.98 v73.15,57.66
SDA1_1  (via drill 0.7, 0.7 pad 0.95)
  Top 0.254: 144.02,72.14 145.03,73.15 145.03,85.6 144.27,86.36 v144.27,86.87
  Top 0.305: 144.27,72.39 144.02,72.14 141.73,69.85 139.06,69.85 138.18,68.96 138.18,60.45 136.91,59.18 v123.95,59.18 v111.25,59.18 v99.06,59.18 88.39,59.18 88.14,59.18 v86.87,59.18
  Bottom 0.305: MUX_I2C1.1B2 138.78,87.47 139.95,88.65 144.02,88.65 144.27,88.39 v144.27,86.87 | 21.SDA 86.37,62.75 86.11,62.48 86.11,59.94 v86.87,59.18 | 23.SDA 111.52,62.75 111.25,62.48 v111.25,59.18 | 22.SDA 99.33,62.75 99.06,62.48 v99.06,59.18 | 24.SDA 124.73,62.75 123.95,61.98 v123.95,59.18
SDA1_2  (via drill 0.7, 0.7 pad 0.95)
  Top 0.305: v138.18,89.41 130.81,82.04 v130.81,80.26 130.81,80.01 130.71,79.91 v119.38,79.91 v106.17,79.91 v95,79.91 95.41,79.91 | v130.56,72.64 v130.56,74.68
  Bottom 0.305: MUX_I2C1.1B3 138.13,89.36 v138.18,89.41 | 28.SDA 86.88,75.45 86.61,75.18 86.61,73.66 87.63,72.64 94.49,72.64 95,73.15 v95,79.91 | 27.SDA 99.33,75.45 99.06,75.18 99.06,73.15 99.57,72.64 106.17,72.64 v106.17,79.91 | 26.SDA 112.03,75.45 111.76,75.18 111.76,73.15 112.27,72.64 119.38,72.64 v119.38,79.91 | 25.SDA 125.23,75.45 124.46,74.68 124.46,72.64 v130.56,72.64 | v130.56,74.68 130.56,80.01 v130.81,80.26
SDA1_3  (via drill 0.7 pad 0.95)
  Top 0.305: v136.4,89.15 136.4,88.9 128.27,80.77 81.79,80.77 | 55.88,80.77 44.29,80.77 v44.2,80.68 | 55.88,80.77 68.07,80.77 | 68.07,80.77 81.79,80.77 | v55.88,80.68 55.88,80.77 | v68.07,80.68 68.07,80.77 | v81.79,78.23 81.79,80.77
  Bottom 0.305: v136.4,89.15 136.72,89.15 137.48,88.39 MUX_I2C1.1B4 | 32.SDA 35.83,75.45 35.56,75.18 35.56,73.15 36.58,72.14 42.67,72.14 42.67,79.15 v44.2,80.68 | 30.SDA 48.53,75.45 48.26,75.18 48.26,73.66 49.78,72.14 54.36,72.14 55.88,73.66 v55.88,80.68 | 31.SDA 61.23,75.45 60.96,75.18 60.96,73.15 61.98,72.14 67.06,72.14 68.07,73.15 v68.07,80.68 | 29.SDA 73.93,75.45 73.66,75.18 73.66,73.15 74.68,72.14 79.76,72.14 81.79,74.17 v81.79,78.23
SDA2  (via drill 0.7, 0.7 pad 0.7, 0.7 pad 0.95)
  Top 0.508: v33.53,74.17 33.53,68.58 31.75,66.8 27.94,66.8 27.94,41.27 52.7,16.51 55.24,16.51 56.52,17.78 90.81,17.78 92.08,19.05 v167.13,19.05 v180.97,19.05 | v190.37,19.05 v185.42,19.05
  Bottom 0.305: MUX_I2C2.1A 29.59,86.99 30.48,87.88 33.02,87.88 33.53,87.38 v33.53,74.17
  Bottom 0.508: SV1.6 v190.37,19.05 | v185.42,19.05 v180.97,19.05 | R9.1 171.55,11.94 169.42,11.94 167.13,14.22 v167.13,19.05
SDA2_0  (via drill 0.7 pad 0.95)
  Top 0.305: v33.53,88.9 33.53,85.34 35.56,85.34 | 35.56,85.34 37.08,85.34 38.1,84.33 v47.75,84.33 v60.45,84.33 v73.66,84.33 | v35.56,86.36 35.56,85.34
  Bottom 0.305: MUX_I2C2.1B1 28.94,87.36 30.48,88.9 v33.53,88.9 | 33.SDA 35.83,88.15 35.56,87.88 v35.56,86.36 | 34.SDA 48.02,88.15 47.75,87.88 v47.75,84.33 | 35.SDA 60.72,88.15 60.45,87.88 v60.45,84.33 | 36.SDA 73.93,88.15 73.66,87.88 v73.66,84.33
SDA2_1  (via drill 0.7 pad 0.95)
  Top 0.305: v32.51,90.17 32.51,84.33 36.58,84.33 36.58,82.8 37.18,82.2 38.96,82.2 39.06,82.3 81.03,82.3 83.06,84.33 v86.11,84.33 v99.06,84.33 v111.25,84.33 v124.46,84.33
  Bottom 0.305: MUX_I2C2.1B2 28.29,87.47 30.99,90.17 v32.51,90.17 | 37.SDA 86.37,88.15 86.11,87.88 v86.11,84.33 | 38.SDA 99.33,88.15 99.06,87.88 v99.06,84.33 | 39.SDA 111.52,88.15 111.25,87.88 v111.25,84.33 | 40.SDA 124.73,88.15 124.46,87.88 v124.46,84.33
SDA2_2  (via drill 0.7 pad 0.95)
  Top 0.305: 118.87,106.93 132.33,106.93 v132.59,106.68 | 118.87,106.93 106.17,106.93 | 106.17,106.93 95.5,106.93 | 95.5,106.93 33.53,106.93 27.43,100.84 v27.43,95.25 | v95.5,106.84 95.5,106.93 | v118.87,106.84 118.87,106.93 | v106.17,106.84 106.17,106.93
  Bottom 0.305: MUX_I2C2.1B3 27.64,88.05 27.34,88.35 27.34,95.15 v27.43,95.25 | 44.SDA 86.37,100.85 86.11,100.58 86.11,99.06 88.14,97.03 94.49,97.03 95.5,98.04 v95.5,106.84 | 41.SDA 124.73,100.85 124.46,100.58 124.46,99.06 125.48,98.04 131.06,98.04 132.59,99.57 v132.59,106.68 | 42.SDA 112.03,100.85 111.76,100.58 111.76,98.55 112.78,97.54 117.35,97.54 118.87,99.06 v118.87,106.84 | 43.SDA 99.33,100.85 99.06,100.58 99.06,98.04 99.57,97.54 105.66,97.54 106.17,98.04 v106.17,106.84
SDA2_3  (via drill 0.7, 0.7 pad 0.95)
  Top 0.305: v25.4,88.9 23.88,90.42 23.88,95.76 v26.16,98.04 | v34.8,103.63 35.56,104.39 v42.67,104.39 v54.86,104.39 v68.58,104.39 71.12,104.39 71.37,104.39 80.52,104.39 v80.77,104.14
  Bottom 0.305: MUX_I2C2.1B4 26.99,87.31 v25.4,88.9 | v26.16,98.04 27.94,98.04 30.73,100.84 32,100.84 v34.8,103.63 | 48.SDA 35.83,100.85 35.56,100.58 35.56,98.04 37.08,96.52 41.15,96.52 42.67,98.04 v42.67,104.39 | 47.SDA 48.53,100.85 48.26,100.58 48.26,98.04 49.78,96.52 54.86,96.52 v54.86,104.39 | 46.SDA 61.23,100.85 60.96,100.58 60.96,97.54 61.47,97.03 68.07,97.03 68.58,97.54 v68.58,104.39 | 45.SDA 74.43,100.85 74.17,100.58 74.17,97.03 80.77,97.03 v80.77,104.14
SDA3  (via drill 0.7 pad 0.95)
  Top 0.305: 88.39,138.18 v88.39,137.16
  Top 0.508: v88.39,144.53 88.39,138.18 | v95.89,146.69 144.78,146.69 166.37,125.09 166.37,97.79 186.69,97.79 192.41,92.08 214.5,92.08 214.55,92.02 214.55,88.94 v214.25,88.65 | 206.38,24.38 206.38,31.75 v212.09,31.75 | 206.38,24.38 206.38,24.13 SV5.3 | v207.01,16.76 207.52,17.27 207.52,23.88 206.88,23.88 206.38,24.38
  Bottom 0.305: MUX_I2C3.1A 87.5,138.05 v88.39,137.16
  Bottom 0.508: v95.89,146.69 90.55,146.69 v88.39,144.53 | v212.09,31.75 213.11,31.75 214.25,32.9 v214.25,88.65 | R5.1 206.25,16 v207.01,16.76
SDA3_0  (via drill 0.7 pad 0.95)
  Top 0.305: v90.93,134.11 90.93,132.59 87.12,132.59 86.36,131.83 84.58,131.83 84.07,131.32 84.07,121.67 83.06,120.65 83.06,109.47 83.31,109.22 v86.11,109.22 v98.04,109.22 v111.25,109.22 v124.46,109.22
  Bottom 0.305: MUX_I2C3.1B1 85.32,138.68 90.17,138.68 90.93,137.92 v90.93,134.11 | 49.SDA 124.73,113.55 124.46,113.28 v124.46,109.22 | 50.SDA 111.52,113.55 111.25,113.28 v111.25,109.22 | 51.SDA 98.82,113.55 98.04,112.78 v98.04,109.22 | 52.SDA 86.37,113.55 86.11,113.28 v86.11,109.22
SDA3_1  (via drill 0.7 pad 0.95)
  Top 0.305: v35.05,109.22 v48.26,109.22 v60.96,109.22 v73.66,109.22 80.26,109.22 80.26,123.44 v81.79,124.97
  Bottom 0.305: MUX_I2C3.1B2 91.28,139.35 91.95,138.68 91.95,133.35 88.9,130.3 83.57,130.3 83.57,127.76 83.57,127.25 83.57,126.75 v81.79,124.97 | 56.SDA 35.83,113.55 35.05,112.78 v35.05,109.22 | 55.SDA 48.53,113.55 48.26,113.28 v48.26,109.22 | 54.SDA 61.23,113.55 60.96,113.28 v60.96,109.22 | 53.SDA 73.93,113.55 73.66,113.28 v73.66,109.22
SDA3_2  (via drill 0.7, 0.7 pad 0.95)
  Top 0.305: v95.25,139.95 97.03,138.18 97.03,134.87 v96.27,134.11 | v94.49,132.33 95.25,131.57 v97.54,131.57 v106.17,131.57 v119.38,131.57 v131.57,131.57
  Bottom 0.305: v95.25,139.95 85.35,139.95 MUX_I2C3.1B3 | v94.49,132.33 v96.27,134.11 | v97.54,131.57 97.54,131.06 94.49,128.02 94.49,123.44 85.85,123.44 85.85,125.48 86.63,126.25 60.SDA | 59.SDA 99.33,126.25 99.06,125.98 99.06,123.44 106.17,123.44 v106.17,131.57 | 58.SDA 111.52,126.25 111.25,125.98 111.25,123.44 119.38,123.44 v119.38,131.57 | 57.SDA 124.22,126.25 123.95,125.98 123.95,123.44 131.06,123.44 131.57,123.95 v131.57,131.57
SDA3_3  (via drill 0.7, 0.7 pad 0.95)
  Top 0.305: v82.3,143.51 81.28,144.53 73.91,144.53 73.15,143.76 73.15,141.22 72.14,140.21 v72.14,133.1 v67.56,133.1 v55.88,133.1 v43.69,133.1
  Bottom 0.305: v82.3,143.51 83.06,142.75 83.06,140.72 83.12,140.65 MUX_I2C3.1B4 | 64.SDA 35.83,126.25 35.56,125.98 35.56,123.95 36.07,123.44 42.16,123.44 43.69,124.97 v43.69,133.1 | 63.SDA 48.53,126.25 48.26,125.98 48.26,123.95 48.77,123.44 54.36,123.44 55.88,124.97 v55.88,133.1 | 62.SDA 61.23,126.25 60.96,125.98 60.96,123.95 61.47,123.44 67.56,123.44 v67.56,133.1 | 61.SDA 72.38,126.25 72.14,126.49 v72.14,133.1
VDD  (via drill 0.35, 0.7 pad 0.7, 0.7 pad 0.95)  (82 unrouted)
  Top 0.305: v76.71,142.75 80.26,142.75 85.34,137.67 v85.34,134.87 | v29.72,92.46 27.94,90.68 27.94,89.41 24.64,86.11 v22.86,86.11
  Top 0.508: v80.26,28.86 82.55,26.57 v82.55,19.05 | v186.69,35.56 186.69,29.21 v187.32,28.57 | v135.13,77.72 135.13,81.79 136.4,83.06 v143.26,83.06
  Bottom 0.203: C5.1 75.44,144.27 75.31,144.15 | 133.86,78.23 C3.1 | v80.26,28.86 84.49,28.86 85.34,29.72 85.34,31.24 85.09,31.5 C2.1
  Bottom 0.254: 50.67,37.97 49.8,38.85 2.VDD_IO 47.26,38.85 v47.24,38.86 | 50.8,37.85 51.05,37.59 2.SENB/CS | 2.VDD 50.8,37.85 | 50.8,37.85 50.67,37.97 | 2.A0 51.55,39.03 51.54,39.02 51.54,38.84 50.67,37.97 | 1.VDD_IO 37.17,38.85 37.18,38.84 37.36,38.84 38.35,37.85 | 3.A1 63.75,38.86 | 63.75,38.86 63.75,37.85 | 63.75,37.85 3.SENB/CS | 3.VDD 63.75,37.85 | 63.75,38.86 63.73,38.84 62.58,38.84 62.57,38.85 3.VDD_IO 62.05,38.86 v59.94,38.86 | 4.A0 4.A1 76.45,38.86 | 76.45,38.86 76.45,37.85 | 76.45,37.85 4.SENB/CS | 76.45,37.85 4.VDD | 76.45,38.86 76.14,38.86 76.12,38.84 75.28,38.84 75.26,38.86 74.78,38.86 4.VDD_IO 72.66,38.85 v72.64,38.86 | 5.SENB/CS 89.15,37.85 | 89.15,37.85 89.16,37.85 5.VDD v91.95,37.85 | 5.VDD_IO 87.47,38.86 87.96,38.86 87.98,38.84 88.14,38.84 89.13,37.85 89.15,37.85 | 6.VDD_IO 100.67,38.85 100.68,38.84 100.86,38.84 101.47,38.23 | 101.47,38.23 101.85,37.85 101.85,37.84 | 101.85,37.84 6.SENB/CS | 101.85,37.84 103.03,37.84 6.VDD v104.39,37.85 | 6.A0 102.35,39.03 102.34,39.02 102.34,38.86 101.7,38.23 101.47,38.23 | 7.A1 114.55,38.86 | 114.55,38.86 114.55,37.85 | 114.55,37.85 7.SENB/CS | 7.VDD_IO 112.88,38.86 113.36,38.86 113.38,38.84 114.22,38.84 114.24,38.86 114.55,38.86 | 114.55,37.85 7.VDD v117.86,37.85 | 8.A0 8.A1 127.25,38.86 | 127.25,38.86 127.25,37.85 | 127.25,37.85 8.SENB/CS | 127.25,37.85 8.VDD v130.3,37.85 | 8.VDD_IO 125.58,38.86 126.06,38.86 126.08,38.84 126.92,38.84 126.94,38.86 127.25,38.86 | 9.SENB/CS 127.25,50.54 | 127.25,50.54 127.26,50.55 9.VDD 130.3,50.55 v130.81,50.04 | 9.VDD_IO 125.58,51.56 126.06,51.56 126.08,51.54 126.24,51.54 127.23,50.54 127.25,50.54 | 10.VDD_IO 113.37,51.55 113.38,51.54 113.56,51.54 114.17,50.93
  Bottom 0.254: 114.17,50.93 114.55,50.55 | 114.55,50.55 114.55,50.54 10.SENB/CS | 114.55,50.55 114.56,50.55 10.VDD 117.34,50.55 v118.11,49.78 | 10.A0 115.05,51.8 114.17,50.93 | 11.A1 101.85,51.56 | 101.85,51.56 101.85,50.55 | 101.85,50.55 11.SENB/CS | 101.85,50.55 11.VDD 104.65,50.55 v105.16,50.04 | 11.VDD_IO 100.67,51.55 100.68,51.54 101.83,51.54 101.85,51.56 | 12.A0 12.A1 89.15,51.56 | 89.15,51.56 89.15,50.55 | 89.15,50.55 12.SENB/CS | 12.VDD_IO 87.47,51.56 87.96,51.56 87.98,51.54 88.82,51.54 88.84,51.56 89.15,51.56 | 12.VDD 89.15,50.55 | 76.45,50.55 75.46,51.54 75.28,51.54 75.27,51.55 13.VDD_IO 73.16,51.55 v73.15,51.56 | 76.45,50.55 76.45,50.54 13.SENB/CS | 76.45,50.55 76.46,50.55 13.VDD | 14.SENB/CS 63.75,50.55 | 63.75,50.55 63.76,50.55 14.VDD | 63.37,50.93 62.76,51.54 62.58,51.54 62.56,51.56 62.08,51.56 14.VDD_IO 59.96,51.55 v59.94,51.56 | 63.37,50.93 63.75,50.55 | 14.A0 64.25,51.8 63.37,50.93 | 1.VDD 40.9,37.85 v41.66,38.61 | 15.A1 51.05,51.56 | 51.05,51.56 51.05,50.55 | 51.05,50.55 15.SENB/CS | 15.VDD 51.05,50.55 | 51.05,51.56 50.74,51.56 50.72,51.54 49.88,51.54 49.86,51.56 49.38,51.56 15.VDD_IO 46.98,51.55 v46.74,51.31 | 16.A0 16.A1 38.35,50.8 | 38.35,50.8 38.35,50.55 | 38.35,50.55 16.SENB/CS | 38.35,50.8 37.6,51.55 37.53,51.55 37.52,51.54 37.18,51.54 37.17,51.55 16.VDD_IO 34.79,51.55 v34.54,51.31 | 38.35,50.55 16.VDD | 19.A1 63.75,64.26 | 63.75,64.26 63.75,63.25 | 63.75,63.25 19.SENB/CS | 19.VDD_IO 62.57,64.25 62.58,64.24 63.73,64.24 63.75,64.26 | 63.75,63.25 19.VDD v67.06,63.25 | 18.SENB/CS 51.05,63.24 51.05,63.25 | 51.05,63.25 51.06,63.25 18.VDD v53.59,63.25 | 18.VDD_IO 49.38,64.26 49.86,64.26 49.88,64.24 50.06,64.24 50.67,63.63
  Bottom 0.254: 50.67,63.63 51.05,63.25 | 51.55,64.5 50.67,63.63 | 17.SENB/CS 38.35,63.24 | 17.VDD 38.36,63.25 38.35,63.24 | 17.VDD_IO 36.67,64.26 37.16,64.26 37.18,64.24 37.34,64.24 38.34,63.24 38.35,63.24 | 32.SENB/CS 38.35,75.95 | 38.35,75.95 38.35,76.96 | 38.35,76.96 32.A1 | 32.A1 32.A0 | 32.VDD_IO 36.67,76.96 37.16,76.96 37.18,76.94 38.02,76.94 38.04,76.96 38.35,76.96 | 32.VDD 38.35,75.95 | 33.SENB/CS 38.35,88.65 | 38.35,88.65 38.36,88.65 33.VDD v41.66,88.65 | 38.35,88.65 37.36,89.64 37.18,89.64 37.17,89.65 33.VDD_IO | 34.SENB/CS 51.05,88.65 51.06,88.65 | 51.06,88.65 34.VDD v54.1,88.65 | 34.VDD_IO 49.38,89.66 49.86,89.66 49.88,89.64 50.07,89.64 50.68,89.03 | 50.68,89.03 51.06,88.65 | 34.A0 51.55,89.9 50.68,89.03 | 35.A1 63.75,89.66 | 63.75,89.66 63.75,88.65 | 63.75,88.65 35.SENB/CS | 63.75,88.65 35.VDD v67.06,88.65 | 35.VDD_IO 62.57,89.65 62.58,89.64 63.73,89.64 63.75,89.66 | 36.A0 36.A1 76.45,89.66 | 76.45,89.66 76.45,88.65 | 76.45,88.65 36.SENB/CS | 76.45,88.65 36.VDD v80.01,88.65 | 36.VDD_IO 75.27,89.65 75.28,89.64 76.43,89.64 76.45,89.66 | 37.SENB/CS 89.15,88.64 | 89.15,88.64 89.16,88.65 37.VDD v92.46,88.65 | 37.VDD_IO 87.47,89.66 87.96,89.66 87.98,89.64 88.14,89.64 89.14,88.64 89.15,88.64 | 38.SENB/CS 101.85,88.65 | 101.85,88.65 101.86,88.65 38.VDD v105.66,88.65 | 38.VDD_IO 100.17,89.66 100.66,89.66 100.68,89.64 100.84,89.64 101.46,89.02 | 101.46,89.02 101.83,88.65 101.85,88.65 | 38.A0 102.35,89.9 101.46,89.02 | 114.55,88.64 114.55,88.65 39.VDD v118.61,88.65 v118.62,88.65 | 114.55,88.64 39.SENB/CS | 39.A1 114.55,89.66 | 114.55,89.66 114.55,88.64 | 39.VDD_IO 113.37,89.65 113.38,89.64 114.53,89.64 114.55,89.66
  Bottom 0.254: 40.A0 40.A1 127.25,89.66 | 127.25,89.66 127.25,88.65 | 127.25,88.65 40.SENB/CS | 127.25,88.65 40.VDD v130.3,88.65 | 40.VDD_IO 125.58,89.66 126.06,89.66 126.08,89.64 126.92,89.64 126.94,89.66 127.25,89.66 | 20.A0 20.A1 76.45,64.26 | 76.45,64.26 76.45,63.25 | 76.45,63.25 20.SENB/CS | 20.VDD_IO 74.78,64.26 75.26,64.26 75.28,64.24 76.12,64.24 76.14,64.26 76.45,64.26 | 76.45,63.25 20.VDD v79.76,63.25 | 21.SENB/CS 89.15,63.25 | 89.15,63.25 89.16,63.25 21.VDD v92.45,63.25 v92.46,63.25 | 21.VDD_IO 87.47,64.26 87.96,64.26 87.98,64.24 88.14,64.24 89.13,63.25 89.15,63.25 | 22.SENB/CS 101.85,63.25 | 101.85,63.25 101.86,63.25 22.VDD v105.41,63.25 | 22.VDD_IO 100.17,64.26 100.66,64.26 100.68,64.24 100.84,64.24 101.46,63.62 | 101.46,63.62 101.83,63.25 101.85,63.25 | 22.A0 102.35,64.5 101.46,63.62 | 23.SENB/CS 114.55,63.24 114.56,63.25 | 114.56,63.25 23.VDD v118.61,63.25 v118.62,63.25 | 23.A1 114.56,64.26 | 114.56,64.26 114.56,63.25 | 23.VDD_IO 112.88,64.26 113.36,64.26 113.38,64.24 114.22,64.24 114.24,64.26 114.56,64.26 | 127.25,64.26 24.A1 24.A0 | 127.25,64.26 127.25,63.25 | 127.25,63.25 24.SENB/CS | 127.25,63.25 24.VDD v130.81,63.25 | 24.VDD_IO 125.58,64.26 126.06,64.26 126.08,64.24 126.92,64.24 126.94,64.26 127.25,64.26 | v132.59,60.2 132.59,56.64 v133.86,55.37 | 25.SENB/CS 127.25,75.94 | 25.VDD 127.26,75.95 127.25,75.94 | 127.25,75.94 127.23,75.94 126.24,76.94 126.08,76.94 126.06,76.96 125.58,76.96 25.VDD_IO 125.55,76.96 v123.44,76.96 | 26.SENB/CS 114.55,75.95 114.56,75.95 | 114.56,75.95 26.VDD | 114.18,76.33 113.57,76.94 113.38,76.94 113.36,76.96 112.88,76.96 26.VDD_IO 110.5,76.95 v110.49,76.96
  Bottom 0.254: 114.18,76.33 114.56,75.95 | 26.A0 115.05,77.2 114.18,76.33 | 27.A1 101.85,76.96 | 101.85,76.96 101.85,75.95 | 101.85,75.95 27.SENB/CS | 101.85,75.95 27.VDD | 101.85,76.96 101.83,76.94 100.68,76.94 100.67,76.95 27.VDD_IO 100.15,76.96 v98.04,76.96 | 28.A0 28.A1 89.15,76.96 | 89.15,76.96 89.15,75.95 | 89.15,75.95 28.SENB/CS | 89.15,75.95 28.VDD | 89.15,76.96 89.13,76.94 87.98,76.94 87.97,76.95 28.VDD_IO v84.85,76.95 v84.84,76.96 | 29.SENB/CS 76.45,75.95 | 76.45,75.95 76.46,75.95 29.VDD | 76.45,75.95 76.43,75.95 75.44,76.94 75.28,76.94 75.26,76.96 74.78,76.96 29.VDD_IO 72.4,76.95 v72.39,76.96 | 31.A1 63.75,76.96 | 63.75,76.96 63.75,75.95 | 63.75,75.95 31.SENB/CS | 63.75,75.95 31.VDD | 63.75,76.96 63.44,76.96 63.42,76.94 62.58,76.94 62.56,76.96 62.08,76.96 31.VDD_IO 62.05,76.96 v59.44,76.96 | 30.SENB/CS 51.05,75.95 51.06,75.95 | 51.06,75.95 30.VDD | 50.68,76.33 50.07,76.94 49.88,76.94 49.87,76.95 30.VDD_IO 47.26,76.95 v47.24,76.96 | 50.68,76.33 51.06,75.95 | 30.A0 51.55,77.2 50.68,76.33 | 32.A1 v38.35,79.75 v38.35,79.76 | 48.A0 48.A1 38.35,102.36 | 38.35,102.36 38.35,101.35 | 38.35,101.35 48.SENB/CS | 38.35,101.35 48.VDD | 38.35,102.36 38.33,102.34 37.18,102.34 37.17,102.35 48.VDD_IO 35.55,102.35 v34.8,101.6 | 47.A1 51.05,102.36 | 51.05,102.36 51.05,101.35 | 51.05,101.35 47.SENB/CS | 51.05,101.35 47.VDD | 51.05,102.36 51.03,102.34 49.88,102.34 49.87,102.35 47.VDD_IO 49.35,102.36 v46.99,102.36 | 46.SENB/CS 63.75,101.35 | 63.75,101.35 63.76,101.35 46.VDD | 63.36,101.72 62.74,102.34 62.58,102.34 62.56,102.36 62.08,102.36 46.VDD_IO v58.94,102.35 v58.93,102.36 | 63.36,101.72 63.73,101.35 63.75,101.35 | 46.A0 64.25,102.6 63.36,101.72
  Bottom 0.254: 45.SENB/CS 76.45,101.34 | 45.VDD 76.46,101.35 76.45,101.34 | 76.45,101.34 76.44,101.34 75.44,102.34 75.28,102.34 75.26,102.36 74.78,102.36 45.VDD_IO 74.75,102.36 v72.14,102.36 | 44.SENB/CS 89.15,101.35 89.16,101.35 | 89.16,101.35 44.VDD | 44.A0 44.A1 89.15,101.6 89.03,101.48 | 89.16,101.35 89.03,101.48 | 89.03,101.48 88.17,102.34 87.98,102.34 87.97,102.35 44.VDD_IO v84.34,102.35 v84.33,102.36 | 43.SENB/CS 101.85,101.35 | 101.85,101.35 101.85,102.36 | 101.85,102.36 43.A1 | 101.85,102.36 101.54,102.36 101.52,102.34 100.68,102.34 100.66,102.36 100.17,102.36 43.VDD_IO 100.15,102.36 v98.3,102.36 | 43.VDD 101.85,101.35 | 42.SENB/CS 114.55,101.35 | 114.55,101.35 114.56,101.35 42.VDD | 114.55,101.35 114.17,101.73 | 114.17,101.73 113.56,102.34 113.38,102.34 113.37,102.35 42.VDD_IO 110.76,102.35 v110.74,102.36 | 42.A0 115.05,102.6 114.17,101.73 | 41.SENB/CS 127.25,101.34 | 41.VDD 127.26,101.35 127.25,101.34 | 127.25,101.34 126.25,102.34 126.08,102.34 126.07,102.35 41.VDD_IO 123.46,102.35 v123.44,102.36 | 49.SENB/CS 127.25,114.05 | 127.25,114.05 127.26,114.05 49.VDD v130.3,114.05 | 127.25,114.05 126.26,115.04 126.08,115.04 126.07,115.05 49.VDD_IO | 50.SENB/CS 114.55,114.05 | 114.55,114.05 114.56,114.05 50.VDD v117.35,114.05 | 114.55,114.05 114.17,114.43 113.56,115.04 113.38,115.04 113.37,115.05 50.VDD_IO | 51.SENB/CS 101.85,114.05 | 101.85,114.05 101.86,114.05 51.VDD v104.9,114.05 | 101.85,114.05 101.85,115.06 | 101.85,115.06 51.A1 | 51.VDD_IO 100.17,115.06 100.66,115.06 100.68,115.04 101.52,115.04 101.54,115.06 101.85,115.06 | 52.SENB/CS 89.15,114.05 | 89.15,114.05 89.15,115.06 | 89.15,115.06 52.A1 52.A0
  Bottom 0.254: 89.15,114.05 52.VDD v91.95,114.05 | 52.VDD_IO 87.47,115.06 87.96,115.06 87.98,115.04 88.82,115.04 88.84,115.06 89.15,115.06 | 53.VDD_IO 75.27,115.05 75.28,115.04 75.46,115.04 76.45,114.05 | 76.45,114.05 76.45,114.04 53.SENB/CS | 76.45,114.05 53.VDD v78.99,114.05 | 54.SENB/CS 63.75,114.05 63.76,114.05 | 63.76,114.05 54.VDD v67.56,114.05 | 54.VDD_IO 62.08,115.06 62.56,115.06 62.58,115.04 62.77,115.04 63.38,114.43 | 63.76,114.05 63.38,114.43 | 54.A0 64.25,115.3 63.38,114.43 | 55.SENB/CS 51.05,114.05 | 51.05,114.05 51.05,115.06 | 51.05,115.06 55.A1 | 55.VDD_IO 49.38,115.06 49.86,115.06 49.88,115.04 50.72,115.04 50.74,115.06 51.05,115.06 | 51.05,114.05 55.VDD v55.11,114.05 v55.12,114.05 | 56.SENB/CS 38.35,114.05 | 38.35,114.05 38.35,115.06 | 38.35,115.06 56.A1 56.A0 | 56.VDD_IO 37.17,115.05 37.18,115.04 38.33,115.04 38.35,115.06 | 38.35,114.05 56.VDD v41.4,114.05 | 64.VDD 38.36,126.75 38.35,126.75 | 64.SENB/CS 38.35,127.76 | 38.35,127.76 64.A1 64.A0 | 38.35,127.76 38.04,127.76 38.02,127.74 37.18,127.74 37.16,127.76 36.67,127.76 64.VDD_IO 35.29,127.75 v34.29,126.75 | 63.SENB/CS 51.05,126.75 | 51.05,126.75 51.05,127.76 | 51.05,127.76 63.A1 | 51.05,127.76 50.74,127.76 50.72,127.74 49.88,127.74 49.86,127.76 49.38,127.76 63.VDD_IO 47.49,127.75 v47.24,127.51 | 63.VDD 51.05,126.75 | 62.SENB/CS 63.75,126.75 63.76,126.75 | 63.76,126.75 62.VDD | 63.36,127.12 62.74,127.74 62.58,127.74 62.56,127.76 62.08,127.76 62.VDD_IO 59.93,127.75 v59.69,127.51 | 63.36,127.12 63.73,126.75 63.76,126.75 | 62.A0 64.25,128 63.36,127.12 | 61.SENB/CS 76.45,126.74 | 61.VDD 76.46,126.75 76.45,126.74 | 76.45,126.74 75.45,127.74 75.28,127.74 75.27,127.75 61.VDD_IO 74.75,127.76 73.66,127.76 v73.66,129.79
  Bottom 0.254: 59.SENB/CS 101.85,126.75 | 101.85,126.75 101.85,127.76 | 101.85,127.76 59.A1 | 101.85,127.76 101.54,127.76 101.52,127.74 100.68,127.74 100.66,127.76 100.17,127.76 59.VDD_IO 98.03,127.75 v97.79,127.51 | 59.VDD 101.85,126.75 | 58.SENB/CS 114.55,126.75 | 114.55,126.75 114.56,126.75 58.VDD | 114.17,127.13 113.56,127.74 113.38,127.74 113.36,127.76 112.88,127.76 58.VDD_IO 110.22,127.75 v109.98,127.51 | 114.17,127.13 114.55,126.75 | 58.A0 115.05,128 114.17,127.13 | 57.SENB/CS 127.25,126.74 | 57.VDD 127.26,126.75 127.25,126.74 | 127.25,126.74 126.25,127.74 126.08,127.74 126.07,127.75 57.VDD_IO 125.55,127.76 v123.19,127.76 | v135.13,77.72 v135.13,74.17
  Bottom 0.305: MUX_I2C2.VCC 25.69,77.47 25.44,77.22 22.86,77.22 C4.1 | MUX_I2C3.VCC 77.51,141.95 v76.71,142.75 75.31,144.15 74.68,144.78 v74.68,146.05 | v17.78,75.18 18.92,76.33 | MUX_I2C0.VCC 80.26,28.21 v80.26,28.86 | MUX_I2C1.VCC 136.18,77.76 136.14,77.72 v135.13,77.72 134.37,77.72 133.86,78.23 | v30.23,50.55 v23.11,50.55 | v33.02,119.13 v28.96,119.13 | v34.04,93.98 31.24,93.98 v29.72,92.46 | v22.86,86.11 20.83,88.14 v19.81,88.14 | 1.SENB/CS 38.35,37.85 1.VDD | 17.VDD v41.66,63.25 | 18.A0 51.55,64.5 | 50.A0 115.05,115.3 114.17,114.43 | 60.SENB/CS 89.15,126.75 | 89.15,126.75 89.15,127.51 | 89.15,127.51 89.15,128.27 | 89.15,128.27 60.A1 | 89.15,127.51 88.91,127.75 88.87,127.75 88.83,127.71 87.97,127.71 87.93,127.75 60.VDD_IO v86.12,127.75 v86.11,127.76 | 60.VDD 89.15,126.75 | 60.A0 89.32,128.44 89.15,128.27
  Bottom 0.508: v82.55,19.05 v82.55,14.48 | C1.1 188.47,27.43 v187.32,28.57 177.8,19.05 v177.8,12.83 | SV2.1 186.77,41.91 | 186.77,41.91 v182.25,41.91 | v155.96,97.28 167.77,97.28 v169.67,99.19 | U$3.4 179.78,52.78 180.03,53.03 SV6.2 180.03,61.75 v179.53,62.26 | v167.89,110.74 v156.97,110.74 | v196.34,93.73 196.34,81.03 193.55,78.23 | v182.63,74.93 190.25,74.93 193.55,78.23 | 193.55,78.23 v193.55,74.42 | v143.26,83.06 v148.59,83.06 | v84.84,79.5 v84.84,85.34 | v186.69,35.56 186.69,41.83 186.77,41.91 | 18.92,76.33 22.73,76.33 22.86,76.45 22.86,77.22 | R9.2 176.66,11.68 v177.8,12.83 | R8.2 176.78,6.1 177.8,7.11 v177.8,12.83 | R2.2 170.43,37.08 170.43,31.24 R3.2 | R4.2 198.12,10.92 198.12,16 | 198.12,16 v198.12,18.8 | R5.2 198.12,16
  pour Top: -1.78,165.1 217.93,165.1 218.69,164.34 218.69,-3.3 218.19,-3.81 -1.27,-3.81 -2.29,-2.79 -2.29,164.59

## Text on the board
Reference: 20
tDocu: 64 node, 4x 8-2 MUX / Teensy 3.6 / HC-06 BT Module / 1000mAh LiPo Battery / / Max Houghton 18/06/2018 / Surgical Technologies